# EAGLE schematic sterowanie_przekaźnik (EAGLE 8.0.0)
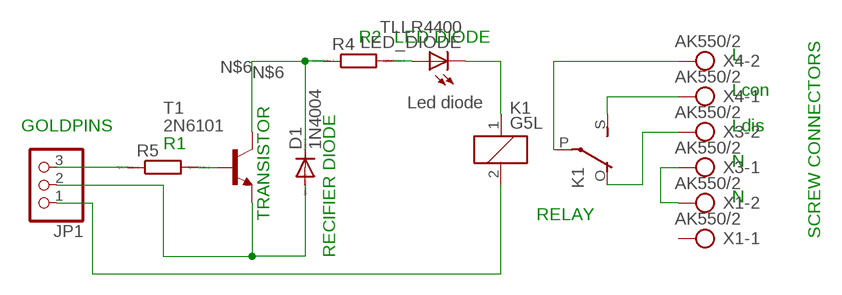
[diagram p0: schematic, sheet 1]

## Parts
D1  1N4004  [DO41-10]
JP1  PINHD-1X3  [1X03]
K1  G5L  [G5LE]
LED_DIODE  TLLR4400  [LED3MM]
R4  R0207/10  [0207/10]
R5  R0207/10  [0207/10]
T1  2N6101  [TO220]
X1  AK550/2  [AK550/2]
X3  AK550/2  [AK550/2]
X4  AK550/2  [AK550/2]

## Nets
N$1: K1.P(2:P) X4.2
N$2: K1.S(2:S) X4.1
N$3: X1.2 X3.1
N$4: K1.1 LED_DIODE.K(C)
N$5: JP1.3 R5.1
N$6: D1.C R4.1 T1.2(C)
N$7: D1.A JP1.2 T1.3(E)
N$8: K1.O(2:O) X3.2
N$9: JP1.1 K1.2
N$10: R5.2 T1.1(B)
N$11: LED_DIODE.A R4.2
Unconnected: X1.1

## Notes on the sheet
- R2 | LED DIODE
- L
- Lcon
- RECIFIER DIODE
- GOLDPINS | Ldis
- R1
- N
- N
- TRANSISTOR | RELAY
- SCREW CONNECTORS

## Library data of the parts
D1 = diode:1N4004: DIODE general purpose rectifier, 1 A
JP1 = pinhead:PINHD-1X3: PIN HEADER
K1 = relay:G5L: RELAY 1 x switch, 10 A/120 V AC, 8 A/30 V ADC, Omron; OC_FARNELL: unknown; OC_NEWARK: unknown
LED_DIODE = led:TLLR4400: Low Current (2mA) LED 3 mm Tinted Diffused Package color RED Source: Data sheet <http://www.farnell.com/datasheets/391100.pdf>; MF: Led diode; OC_FARNELL: 1612437
R4 R5 = eagle-ltspice:R: RESISTOR, European symbol; SPICEMODEL: NONE; SPICEPREFIX: R
T1 = transistor:2N6101: NPN TRANSISTOR
X1 X3 X4 = con-ptr500:AK550/2: CONNECTOR; OC_FARNELL: unknown; OC_NEWARK: unknown